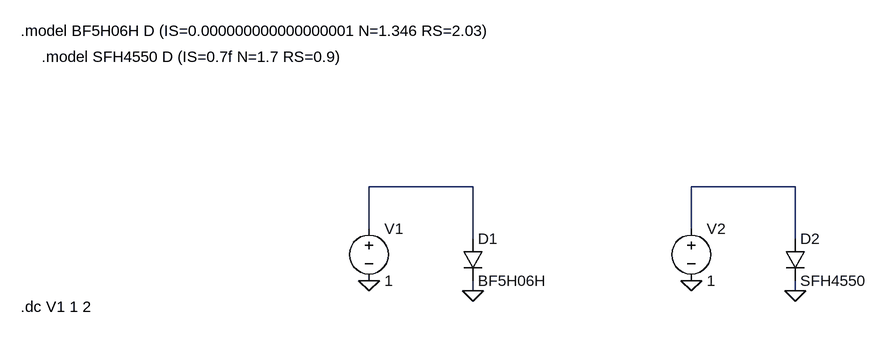
[diagram p0: schematic Diode Sweeps.asc]
Diode Sweeps.asc, the LTspice schematic file:
Version 4.1
SHEET 1 3504 680
WIRE 480 240 320 240
WIRE 976 240 816 240
WIRE 320 304 320 240
WIRE 816 304 816 240
WIRE 480 320 480 240
WIRE 976 320 976 240
WIRE 480 400 480 384
WIRE 976 400 976 384
FLAG 320 384 0
FLAG 480 400 0
FLAG 816 384 0
FLAG 976 400 0
SYMBOL diode 464 320 R0
SYMATTR InstName D1
SYMATTR Value BF5H06H
SYMBOL voltage 320 288 R0
SYMATTR InstName V1
SYMATTR Value 1
SYMBOL diode 960 320 R0
SYMATTR InstName D2
SYMATTR Value SFH4550
SYMBOL voltage 816 288 R0
SYMATTR InstName V2
SYMATTR Value 1
TEXT -216 0 Left 2 !.model BF5H06H D (IS=0.000000000000000001 N=1.346 RS=2.03)
TEXT -216 424 Left 2 !.dc V1 1 2
TEXT -184 40 Left 2 !.model SFH4550 D (IS=0.7f N=1.7 RS=0.9)

The netlist it stands for:
* Diode Sweeps.asc
D1 N001 0 BF5H06H
V1 N001 0 1
D2 N002 0 SFH4550
V2 N002 0 1
.model D D
.lib standard.dio
.model BF5H06H D (IS=0.000000000000000001 N=1.346 RS=2.03)
.dc V1 1 2
.model SFH4550 D (IS=0.7f N=1.7 RS=0.9)
.backanno
.end